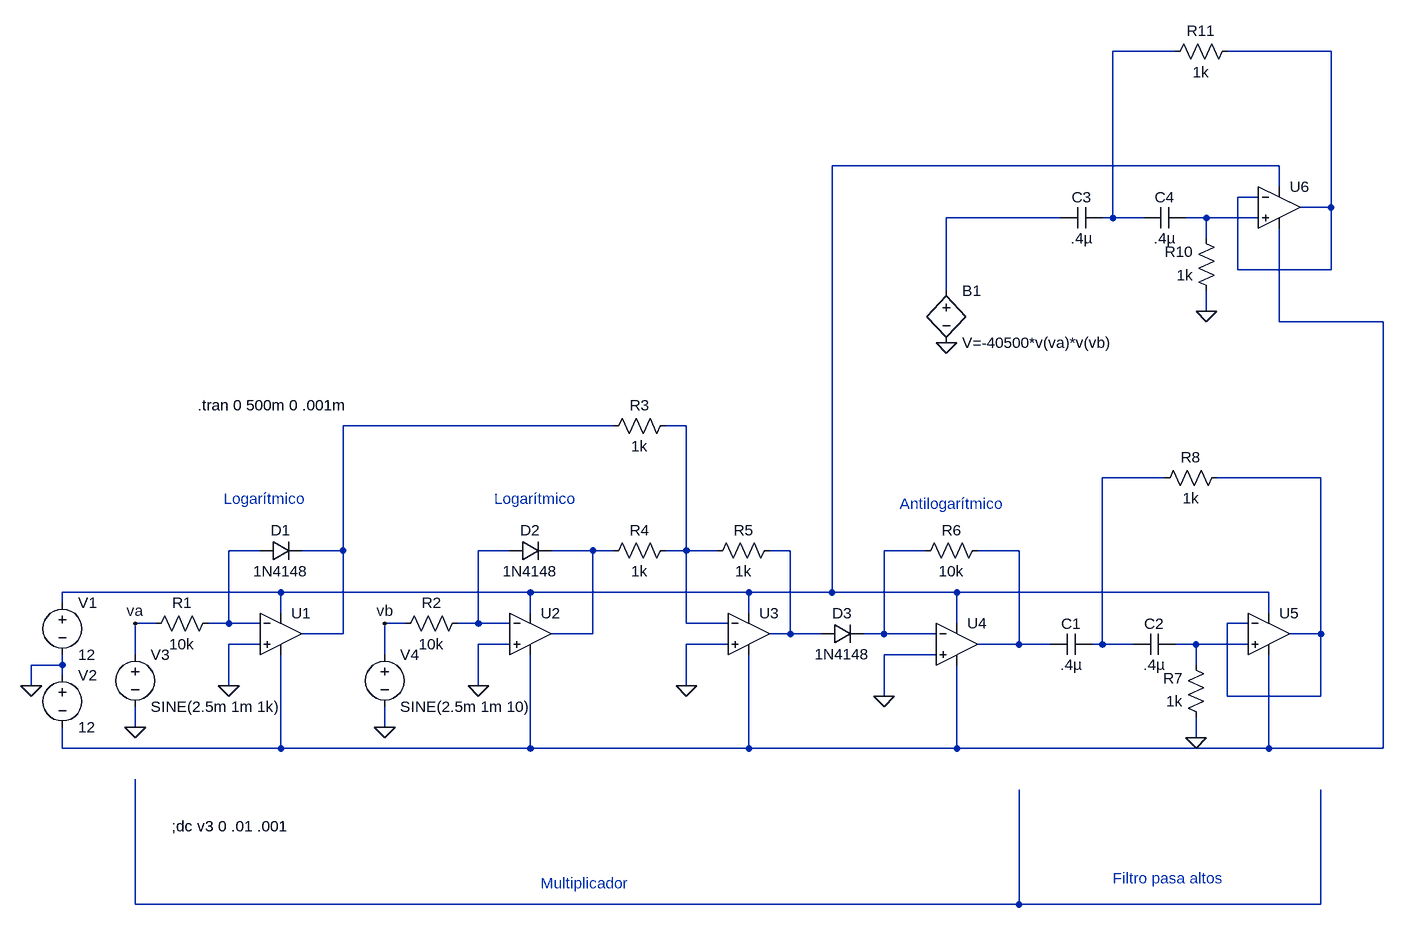
[diagram p0: schematic Multiplicador y AM.asc]
Multiplicador y AM.asc, the LTspice schematic file:
Version 4
SHEET 1 1432 680
WIRE 688 -1104 592 -1104
WIRE 928 -1104 768 -1104
WIRE 848 -928 160 -928
WIRE 848 -896 848 -928
WIRE 816 -880 784 -880
WIRE 928 -864 928 -1104
WIRE 928 -864 880 -864
WIRE 512 -848 336 -848
WIRE 592 -848 592 -1104
WIRE 592 -848 576 -848
WIRE 640 -848 592 -848
WIRE 736 -848 704 -848
WIRE 816 -848 736 -848
WIRE 736 -816 736 -848
WIRE 784 -768 784 -880
WIRE 928 -768 928 -864
WIRE 928 -768 784 -768
WIRE 336 -736 336 -848
WIRE 736 -704 736 -736
WIRE 848 -688 848 -832
WIRE 1008 -688 848 -688
WIRE -176 -528 -592 -528
WIRE -64 -528 -96 -528
WIRE 672 -448 576 -448
WIRE 912 -448 752 -448
WIRE -720 -336 -768 -336
WIRE -592 -336 -592 -528
WIRE -592 -336 -656 -336
WIRE -336 -336 -384 -336
WIRE -208 -336 -272 -336
WIRE -176 -336 -208 -336
WIRE -64 -336 -64 -528
WIRE -64 -336 -96 -336
WIRE -16 -336 -64 -336
WIRE 96 -336 64 -336
WIRE 304 -336 240 -336
WIRE 448 -336 384 -336
WIRE -688 -272 -1024 -272
WIRE -304 -272 -688 -272
WIRE 32 -272 -304 -272
WIRE 160 -272 160 -928
WIRE 160 -272 32 -272
WIRE 352 -272 160 -272
WIRE 832 -272 352 -272
WIRE -1024 -256 -1024 -272
WIRE -688 -240 -688 -272
WIRE -304 -240 -304 -272
WIRE 32 -240 32 -272
WIRE 832 -240 832 -272
WIRE -880 -224 -912 -224
WIRE -768 -224 -768 -336
WIRE -768 -224 -800 -224
WIRE -720 -224 -768 -224
WIRE -496 -224 -528 -224
WIRE -384 -224 -384 -336
WIRE -384 -224 -416 -224
WIRE -336 -224 -384 -224
WIRE -64 -224 -64 -336
WIRE 0 -224 -64 -224
WIRE 352 -224 352 -272
WIRE 800 -224 768 -224
WIRE -592 -208 -592 -336
WIRE -592 -208 -656 -208
WIRE -208 -208 -208 -336
WIRE -208 -208 -272 -208
WIRE 96 -208 96 -336
WIRE 96 -208 64 -208
WIRE 144 -208 96 -208
WIRE 240 -208 240 -336
WIRE 240 -208 208 -208
WIRE 320 -208 240 -208
WIRE 912 -208 912 -448
WIRE 912 -208 864 -208
WIRE -720 -192 -768 -192
WIRE -336 -192 -384 -192
WIRE 0 -192 -64 -192
WIRE 448 -192 448 -336
WIRE 448 -192 384 -192
WIRE 496 -192 448 -192
WIRE 576 -192 576 -448
WIRE 576 -192 560 -192
WIRE 624 -192 576 -192
WIRE 720 -192 688 -192
WIRE 800 -192 720 -192
WIRE -912 -176 -912 -224
WIRE -528 -176 -528 -224
WIRE 320 -176 240 -176
WIRE -1024 -160 -1024 -176
WIRE -1024 -160 -1072 -160
WIRE 720 -160 720 -192
WIRE -1024 -144 -1024 -160
WIRE -1072 -128 -1072 -160
WIRE -768 -128 -768 -192
WIRE -384 -128 -384 -192
WIRE -64 -128 -64 -192
WIRE 240 -112 240 -176
WIRE 768 -112 768 -224
WIRE 912 -112 912 -208
WIRE 912 -112 768 -112
WIRE -912 -64 -912 -96
WIRE -528 -64 -528 -96
WIRE 720 -48 720 -80
WIRE -1024 -32 -1024 -64
WIRE -688 -32 -688 -176
WIRE -688 -32 -1024 -32
WIRE -304 -32 -304 -176
WIRE -304 -32 -688 -32
WIRE 32 -32 32 -176
WIRE 32 -32 -304 -32
WIRE 352 -32 352 -160
WIRE 352 -32 32 -32
WIRE 832 -32 832 -176
WIRE 832 -32 352 -32
WIRE 1008 -32 1008 -688
WIRE 1008 -32 832 -32
WIRE -912 208 -912 16
WIRE 448 208 448 32
WIRE 448 208 -912 208
WIRE 912 208 912 32
WIRE 912 208 448 208
FLAG -1072 -128 0
FLAG -912 -64 0
FLAG -768 -128 0
FLAG -528 -64 0
FLAG -384 -128 0
FLAG -64 -128 0
FLAG 240 -112 0
FLAG 720 -48 0
FLAG -912 -224 va
FLAG -528 -224 vb
FLAG 336 -656 0
FLAG 736 -704 0
SYMBOL Opamps\\UniversalOpamp2 -688 -208 R0
SYMATTR InstName U1
SYMBOL diode -720 -320 R270
WINDOW 0 32 32 VTop 2
WINDOW 3 0 32 VBottom 2
SYMATTR InstName D1
SYMATTR Value 1N4148
SYMBOL voltage -1024 -272 R0
WINDOW 123 0 0 Left 2
WINDOW 39 0 0 Left 2
SYMATTR InstName V1
SYMATTR Value 12
SYMBOL voltage -1024 -160 R0
WINDOW 123 0 0 Left 2
WINDOW 39 0 0 Left 2
SYMATTR InstName V2
SYMATTR Value 12
SYMBOL res -784 -240 R90
WINDOW 0 0 56 VBottom 2
WINDOW 3 32 56 VTop 2
SYMATTR InstName R1
SYMATTR Value 10k
SYMBOL voltage -912 -192 R0
WINDOW 123 0 0 Left 2
WINDOW 39 0 0 Left 2
SYMATTR InstName V3
SYMATTR Value SINE(2.5m 1m 1k)
SYMBOL Opamps\\UniversalOpamp2 -304 -208 R0
SYMATTR InstName U2
SYMBOL diode -336 -320 R270
WINDOW 0 32 32 VTop 2
WINDOW 3 0 32 VBottom 2
SYMATTR InstName D2
SYMATTR Value 1N4148
SYMBOL res -400 -240 R90
WINDOW 0 0 56 VBottom 2
WINDOW 3 32 56 VTop 2
SYMATTR InstName R2
SYMATTR Value 10k
SYMBOL voltage -528 -192 R0
WINDOW 123 0 0 Left 2
WINDOW 39 0 0 Left 2
SYMATTR InstName V4
SYMATTR Value SINE(2.5m 1m 10)
SYMBOL Opamps\\UniversalOpamp2 32 -208 R0
SYMATTR InstName U3
SYMBOL res -80 -544 R90
WINDOW 0 0 56 VBottom 2
WINDOW 3 32 56 VTop 2
SYMATTR InstName R3
SYMATTR Value 1k
SYMBOL res -80 -352 R90
WINDOW 0 0 56 VBottom 2
WINDOW 3 32 56 VTop 2
SYMATTR InstName R4
SYMATTR Value 1k
SYMBOL res 80 -352 R90
WINDOW 0 0 56 VBottom 2
WINDOW 3 32 56 VTop 2
SYMATTR InstName R5
SYMATTR Value 1k
SYMBOL Opamps\\UniversalOpamp2 352 -192 R0
SYMATTR InstName U4
SYMBOL diode 144 -192 R270
WINDOW 0 32 32 VTop 2
WINDOW 3 0 32 VBottom 2
SYMATTR InstName D3
SYMATTR Value 1N4148
SYMBOL res 400 -352 R90
WINDOW 0 0 56 VBottom 2
WINDOW 3 32 56 VTop 2
SYMATTR InstName R6
SYMATTR Value 10k
SYMBOL res 736 -64 R180
WINDOW 0 36 76 Left 2
WINDOW 3 36 40 Left 2
SYMATTR InstName R7
SYMATTR Value 1k
SYMBOL cap 560 -208 R90
WINDOW 0 0 32 VBottom 2
WINDOW 3 32 32 VTop 2
SYMATTR InstName C1
SYMATTR Value .4µ
SYMBOL cap 688 -208 R90
WINDOW 0 0 32 VBottom 2
WINDOW 3 32 32 VTop 2
SYMATTR InstName C2
SYMATTR Value .4µ
SYMBOL res 656 -432 R270
WINDOW 0 32 56 VTop 2
WINDOW 3 0 56 VBottom 2
SYMATTR InstName R8
SYMATTR Value 1k
SYMBOL Opamps\\UniversalOpamp2 832 -208 R0
SYMATTR InstName U5
SYMBOL bv 336 -752 R0
SYMATTR InstName B1
SYMATTR Value V=-40500*v(va)*v(vb)
SYMBOL res 752 -720 R180
WINDOW 0 36 76 Left 2
WINDOW 3 36 40 Left 2
SYMATTR InstName R10
SYMATTR Value 1k
SYMBOL cap 576 -864 R90
WINDOW 0 0 32 VBottom 2
WINDOW 3 32 32 VTop 2
SYMATTR InstName C3
SYMATTR Value .4µ
SYMBOL cap 704 -864 R90
WINDOW 0 0 32 VBottom 2
WINDOW 3 32 32 VTop 2
SYMATTR InstName C4
SYMATTR Value .4µ
SYMBOL res 672 -1088 R270
WINDOW 0 32 56 VTop 2
WINDOW 3 0 56 VBottom 2
SYMATTR InstName R11
SYMATTR Value 1k
SYMBOL Opamps\\UniversalOpamp2 848 -864 R0
SYMATTR InstName U6
TEXT -856 88 Left 2 !;dc v3 0 .01 .001
TEXT -816 -560 Left 2 !.tran 0 500m 0 .001m
TEXT -776 -416 Left 2 ;Logarítmico
TEXT -360 -416 Left 2 ;Logarítmico
TEXT 264 -408 Left 2 ;Antilogarítmico
TEXT -288 176 Left 2 ;Multiplicador
TEXT 592 168 Left 2 ;Filtro pasa altos

The netlist it stands for:
* Multiplicador y AM.asc
XU1 0 N011 N003 N006 N007 level.2 Avol=1Meg GBW=10Meg Slew=10Meg ilimit=25m rail=0 Vos=0 phimargin=45 en=0 enk=0 in=0 ink=0 Rin=500Meg  ; pins IN+ IN- V+ V- OUT
D1 N011 N007 1N4148
V1 N003 0 12
V2 0 N006 12
R1 N011 va 10k
V3 va 0 SINE(2.5m 1m 1k)
XU2 0 N012 N003 N006 N013 level.2 Avol=1Meg GBW=10Meg Slew=10Meg ilimit=25m rail=0 Vos=0 phimargin=45 en=0 enk=0 in=0 ink=0 Rin=500Meg  ; pins IN+ IN- V+ V- OUT
D2 N012 N013 1N4148
R2 N012 vb 10k
V4 vb 0 SINE(2.5m 1m 10)
XU3 0 N008 N003 N006 N014 level.2 Avol=1Meg GBW=10Meg Slew=10Meg ilimit=25m rail=0 Vos=0 phimargin=45 en=0 enk=0 in=0 ink=0 Rin=500Meg  ; pins IN+ IN- V+ V- OUT
R3 N008 N007 1k
R4 N008 N013 1k
R5 N014 N008 1k
XU4 0 N015 N003 N006 N016 level.2 Avol=1Meg GBW=10Meg Slew=10Meg ilimit=25m rail=0 Vos=0 phimargin=45 en=0 enk=0 in=0 ink=0 Rin=500Meg  ; pins IN+ IN- V+ V- OUT
D3 N014 N015 1N4148
R6 N016 N015 10k
R7 0 N017 1k
C1 N009 N016 .4µ
C2 N017 N009 .4µ
R8 N009 N010 1k
XU5 N017 N010 N003 N006 N010 level.2 Avol=1Meg GBW=10Meg Slew=10Meg ilimit=25m rail=0 Vos=0 phimargin=45 en=0 enk=0 in=0 ink=0 Rin=500Meg  ; pins IN+ IN- V+ V- OUT
B1 N004 0 V=-40500*v(va)*v(vb)
R10 0 N005 1k
C3 N001 N004 .4µ
C4 N005 N001 .4µ
R11 N001 N002 1k
XU6 N005 N002 N003 N006 N002 level.2 Avol=1Meg GBW=10Meg Slew=10Meg ilimit=25m rail=0 Vos=0 phimargin=45 en=0 enk=0 in=0 ink=0 Rin=500Meg  ; pins IN+ IN- V+ V- OUT
.model D D
.lib standard.dio
;dc v3 0 .01 .001
.tran 0 500m 0 .001m
* Logarítmico
* Logarítmico
* Antilogarítmico
* Multiplicador
* Filtro pasa altos
.lib UniversalOpamps2.sub
.backanno
.end